# EAGLE design Stereo PGA2311 SMD v1,1 (EAGLE 7.5.0)
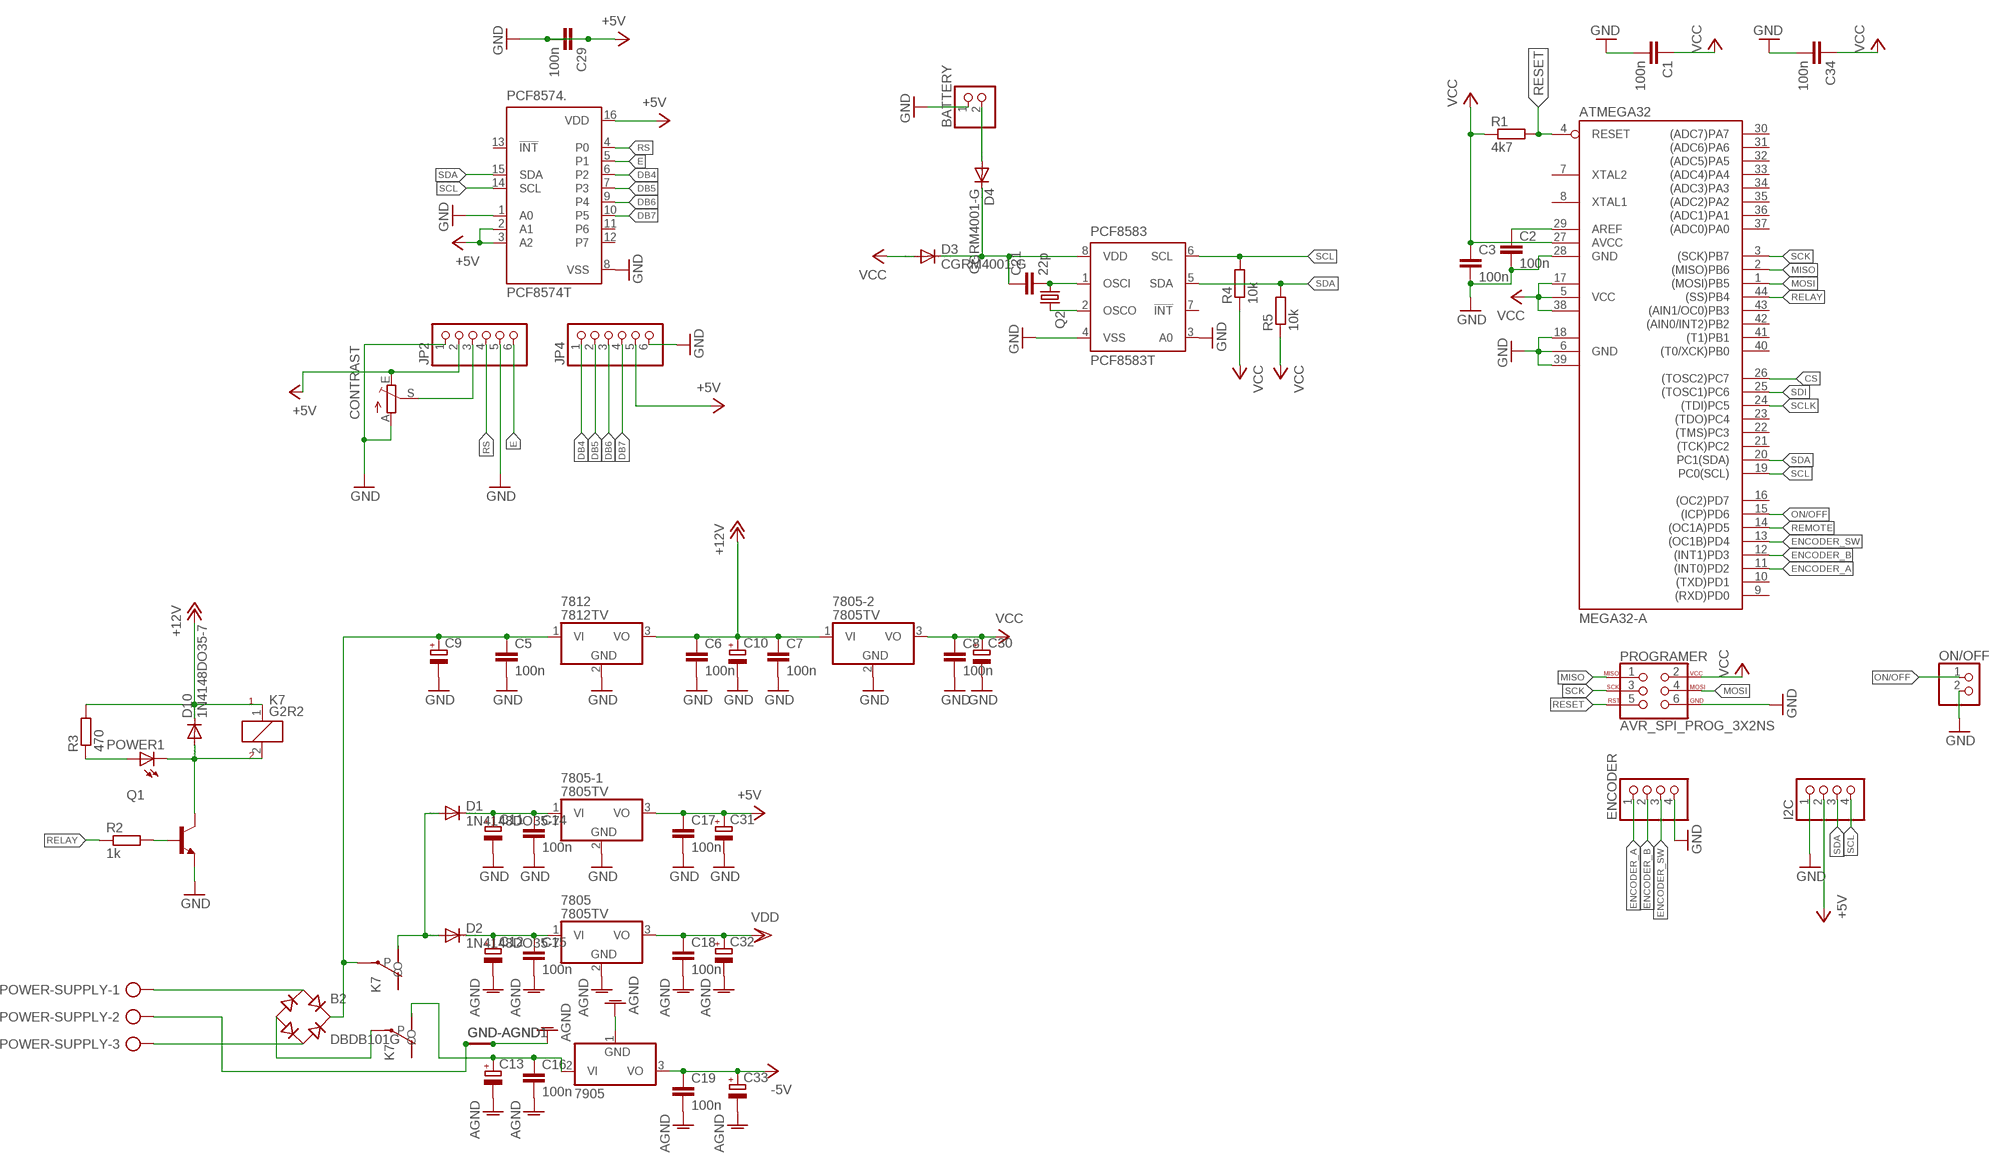
[diagram p0: schematic, sheet 1, part 1 of 2]
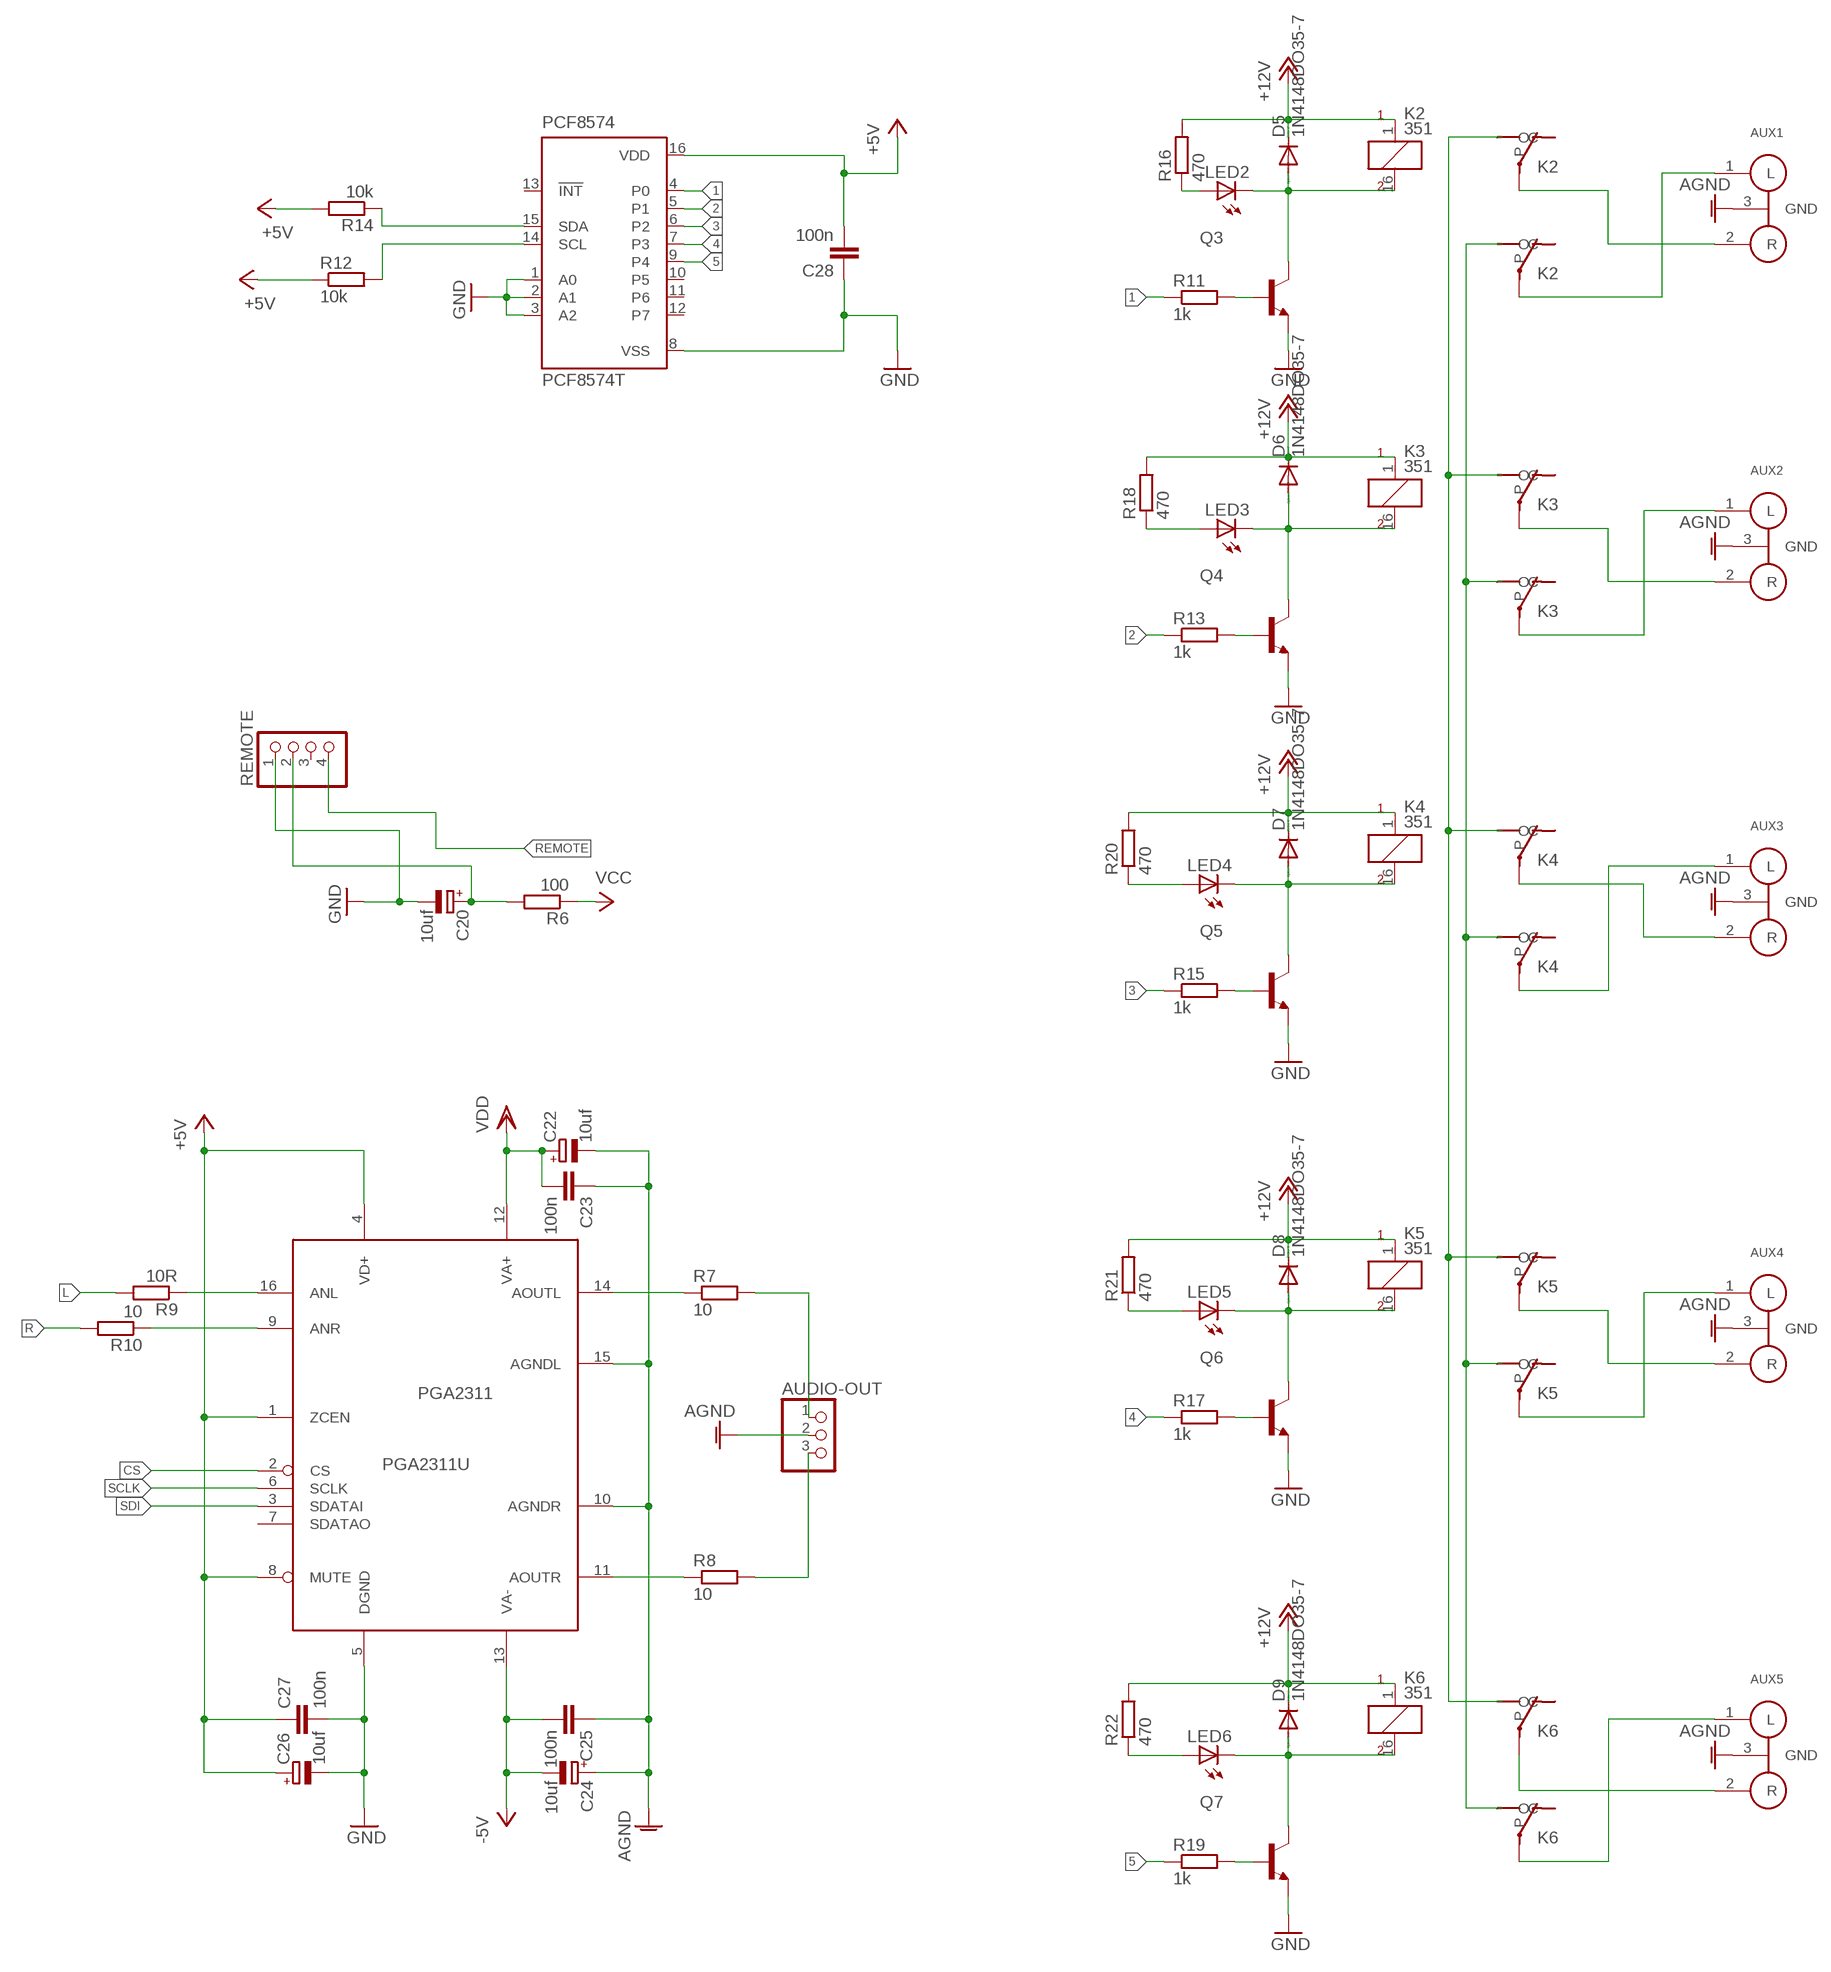
[diagram p1: schematic, sheet 1, part 2 of 2]

## Parts
7805  7805TV  [TO220V]
7805-1  7805TV  [TO220V]
7805-2  7805TV  [TO220V]
7812  7812TV  [TO220V]
7905  79  [TO220V]
ATMEGA32  MEGA32-A  [TQFP44]
AUDIO-OUT  PINHD-1X3  [1X03]
AUX1  RCA-EBAY  [RCA-EBAY]
AUX2  RCA-EBAY  [RCA-EBAY]
AUX3  RCA-EBAY  [RCA-EBAY]
AUX4  RCA-EBAY  [RCA-EBAY]
AUX5  RCA-EBAY  [RCA-EBAY]
B2  DBDB101G  [DB]
BATTERY  PINHD-1X2  [1X02]
C1  100n  C-EUC0805  [C0805]
C2  100n  C-EUC0603  [C0603]
C3  100n  C-EUC0603  [C0603]
C5  100n  C-EU025-030X050  [C025-030X050]
C6  100n  C-EU025-030X050  [C025-030X050]
C7  100n  C-EU025-030X050  [C025-030X050]
C8  100n  C-EU025-030X050  [C025-030X050]
C9  CPOL-EUE2.5-7  [E2,5-7]
C10  CPOL-EUE2.5-7  [E2,5-7]
C11  CPOL-EUE2.5-7  [E2,5-7]
C12  CPOL-EUE2.5-7  [E2,5-7]
C13  CPOL-EUE2.5-7  [E2,5-7]
C14  100n  C-EU025-030X050  [C025-030X050]
C15  100n  C-EU025-030X050  [C025-030X050]
C16  100n  C-EU025-030X050  [C025-030X050]
C17  100n  C-EU025-030X050  [C025-030X050]
C18  100n  C-EU025-030X050  [C025-030X050]
C19  100n  C-EU025-030X050  [C025-030X050]
C20  10uf  CPOL-EUE2-4  [E2-4]
C21  22p  C-EUC0603K  [C0603K]
C22  10uf  CPOL-EU153CLV-0505  [153CLV-0505]
C23  100n  C-EUC0603  [C0603]
C24  10uf  CPOL-EU153CLV-0505  [153CLV-0505]
C25  100n  C-EUC0603  [C0603]
C26  10uf  CPOL-EU153CLV-0505  [153CLV-0505]
C27  100n  C-EUC0603  [C0603]
C28  100n  C-EUC0603  [C0603]
C29  100n  C-EUC0603  [C0603]
C30  CPOL-EUE2.5-7  [E2,5-7]
C31  CPOL-EUE2.5-7  [E2,5-7]
C32  CPOL-EUE2.5-7  [E2,5-7]
C33  CPOL-EUE2.5-7  [E2,5-7]
C34  100n  C-EUC0603  [C0603]
CONTRAST  TRIM_EU-CA6V  [CA6V]
D1  1N4148DO35-7  [DO35-7]
D2  1N4148DO35-7  [DO35-7]
D3  CGRM4001-G  [SOD-123_MINI-SMA]
D4  CGRM4001-G  [SOD-123_MINI-SMA]
D5  1N4148DO35-7  [DO35-7]
D6  1N4148DO35-7  [DO35-7]
D7  1N4148DO35-7  [DO35-7]
D8  1N4148DO35-7  [DO35-7]
D9  1N4148DO35-7  [DO35-7]
D10  1N4148DO35-7  [DO35-7]
ENCODER  PINHD-1X4  [1X04]
GND-AGND  SHORT-HT5  [SHORT_TOP-50]
GND-AGND1  SHORT-HT5  [SHORT_TOP-50]
I2C  PINHD-1X4  [1X04]
JP2  PINHD-1X6  [1X06]
JP4  PINHD-1X6  [1X06]
K2  351  [351]
K3  351  [351]
K4  351  [351]
K5  351  [351]
K6  351  [351]
K7  G2R2  [G2R2]
LED2  LEDCHIPLED_0805  [CHIPLED_0805]
LED3  LEDCHIPLED_0805  [CHIPLED_0805]
LED4  LEDCHIPLED_0805  [CHIPLED_0805]
LED5  LEDCHIPLED_0805  [CHIPLED_0805]
LED6  LEDCHIPLED_0805  [CHIPLED_0805]
ON/OFF  PINHD-1X2  [1X02]
PCF8574  PCF8574T  [SO16W]
PCF8574.  PCF8574T  [SO16W]
PCF8583  PCF8583T  [SO8-7_5]
PGA2311  PGA2311U  [SO16-1]
POWER1  LEDCHIPLED_0805  [CHIPLED_0805]
POWER-SUPPLY  AK300/3  [AK300/3]
PROGRAMER  AVR_SPI_PROG_3X2NS  [2X3-NS]
Q1  BC547A-NPN-TO92-CBE  [TO92-CBE]
Q2  CRYSTALTC26H  [TC26H]
Q3  BC547A-NPN-TO92-CBE  [TO92-CBE]
Q4  BC547A-NPN-TO92-CBE  [TO92-CBE]
Q5  BC547A-NPN-TO92-CBE  [TO92-CBE]
Q6  BC547A-NPN-TO92-CBE  [TO92-CBE]
Q7  BC547A-NPN-TO92-CBE  [TO92-CBE]
R1  4k7  R-EU_R0603  [R0603]
R2  1k  R-EU_R0603  [R0603]
R3  470  R-EU_R0603  [R0603]
R4  10k  R-EU_R0603  [R0603]
R5  10k  R-EU_R0603  [R0603]
R6  100  R-EU_R0603  [R0603]
R7  10  R-EU_R0603  [R0603]
R8  10  R-EU_R0603  [R0603]
R9  10R  R-EU_R0603  [R0603]
R10  10  R-EU_R0603  [R0603]
R11  1k  R-EU_R0603  [R0603]
R12  10k  R-EU_R0603  [R0603]
R13  1k  R-EU_R0603  [R0603]
R14  10k  R-EU_R0603  [R0603]
R15  1k  R-EU_R0603  [R0603]
R16  470  R-EU_R0603  [R0603]
R17  1k  R-EU_R0603  [R0603]
R18  470  R-EU_R0603  [R0603]
R19  1k  R-EU_R0603  [R0603]
R20  470  R-EU_R0603  [R0603]
R21  470  R-EU_R0603  [R0603]
R22  470  R-EU_R0603  [R0603]
REMOTE  PINHD-1X4  [1X04]

## Nets
1: PCF8574.4(P0) R11.1
2: PCF8574.5(P1) R13.1
3: PCF8574.6(P2) R15.1
4: PCF8574.7(P3) R17.1
5: PCF8574.9(P4) R19.1
+5V: 7805-1.3(VO) C17.1 C26.+ C27.1 C28.2 C29.1 C29.2 C31.+ CONTRAST.E I2C.2 JP2.2 JP4.5 PCF8574.16(VDD) PCF8574..2(A1) PCF8574..3(A2) PCF8574..16(VDD) PGA2311.1(ZCEN) PGA2311.4(VD+) PGA2311.8(MUTE) R12.1 R14.2 ; supply symbol labelled GND
+12V: 7805-2.1(VI) 7812.3(VO) C6.1 C7.1 C10.+ D5.C D6.C D7.C D8.C D9.C D10.C K2.1 K3.1 K4.1 K5.1 K6.1 K7.1 R3.2 R16.2 R18.2 R20.2 R21.2 R22.2
-5V: 7905.3(VO) C19.1 C24.- C25.2 C33.+ PGA2311.13(VA-)
AGND: 7805.2(GND) 7905.1(GND) AUDIO-OUT.2 AUX1.3(GND) AUX2.3(GND) AUX3.3(GND) AUX4.3(GND) AUX5.3(GND) C12.- C13.- C15.2 C16.2 C18.2 C19.2 C22.- C23.1 C24.+ C25.1 C32.- C33.- GND-AGND1.2 GND-AGND.2 PGA2311.10(AGNDR) PGA2311.15(AGNDL)
CS: ATMEGA32.26((TOSC2)PC7) PGA2311.2(CS)
DB4: JP4.1 PCF8574..6(P2)
DB5: JP4.2 PCF8574..7(P3)
DB6: JP4.3 PCF8574..9(P4)
DB7: JP4.4 PCF8574..10(P5)
E: JP2.6 PCF8574..5(P1)
ENCODER_A: ATMEGA32.11((INT0)PD2) ENCODER.1
ENCODER_B: ATMEGA32.12((INT1)PD3) ENCODER.2
ENCODER_SW: ATMEGA32.13((OC1B)PD4) ENCODER.3
GND: 7805-1.2(GND) 7805-2.2(GND) 7812.2(GND) ATMEGA32.6(GND) ATMEGA32.18(GND1) ATMEGA32.28(GND) ATMEGA32.39(GND2) BATTERY.1 C1.2 C2.2 C3.2 C5.2 C6.2 C7.2 C8.2 C9.- C10.- C11.- C14.2 C17.2 C20.- C26.- C27.2 C28.1 C30.- C31.- C34.2 CONTRAST.A ENCODER.4 GND-AGND1.1 GND-AGND.1 I2C.1 JP2.1 JP2.5 JP4.6 ON/OFF.2 PCF8574.1(A0) PCF8574.2(A1) PCF8574.3(A2) PCF8574.8(VSS) PCF8574..1(A0) PCF8574..8(VSS) PCF8583.3(A0) PCF8583.4(VSS) PGA2311.5(DGND) POWER-SUPPLY.2 PROGRAMER.6 Q1.E Q3.E Q4.E Q5.E Q6.E Q7.E REMOTE.1
L: K2.S2(3:O) K3.S2(3:O) K4.S2(3:O) K5.S2(3:O) K6.S2(3:O) R9.2
MISO: ATMEGA32.2((MISO)PB6) PROGRAMER.1
MOSI: ATMEGA32.1((MOSI)PB5) PROGRAMER.4
N$1: B2.AC1 POWER-SUPPLY.1
N$2: B2.AC2 POWER-SUPPLY.3
N$3: ATMEGA32.29(AREF) C2.1
N$4: C21.2 PCF8583.1(OSCI) Q2.1
N$5: 7812.1(VI) B2.+ C5.1 C9.+ K7.P2(3:P)
N$6: B2.- K7.P1(2:P)
N$7: 7905.2(VI) C13.+ C16.1 K7.S1(2:O)
N$8: D1.A D2.A K7.S2(3:O)
N$9: 7805.1(VI) C12.+ C15.1 D2.C
N$10: 7805-1.1(VI) C11.+ C14.1 D1.C
N$11: D10.A K7.2 POWER1.C Q1.C
N$12: Q1.B R2.2
N$13: PCF8583.2(OSCO) Q2.2
N$14: C21.1 D3.C D4.C PCF8583.8(VDD)
N$15: BATTERY.2 D4.A
N$16: PGA2311.11(AOUTR) R8.1
N$17: C20.+ R6.2 REMOTE.2
N$18: PGA2311.16(ANL) R9.1
N$19: PGA2311.9(ANR) R10.1
N$20: PGA2311.14(AOUTL) R7.1
N$21: D5.A K2.16 LED2.C Q3.C
N$22: Q3.B R11.2
N$23: LED2.A R16.1
N$24: Q4.B R13.2
N$25: LED3.A R18.1
N$26: Q5.B R15.2
N$27: LED4.A R20.1
N$28: Q6.B R17.2
N$29: LED5.A R21.1
N$30: Q7.B R19.2
N$31: LED6.A R22.1
N$32: D6.A K3.16 LED3.C Q4.C
N$33: AUDIO-OUT.1 R7.2
N$34: AUDIO-OUT.3 R8.2
N$35: AUX5.1(L) K6.P2(3:P)
N$36: AUX5.2(R) K6.P1(2:P)
N$37: AUX4.1(L) K5.P2(3:P)
N$38: AUX4.2(R) K5.P1(2:P)
N$39: AUX3.2(R) K4.P1(2:P)
N$40: AUX3.1(L) K4.P2(3:P)
N$41: AUX2.1(L) K3.P2(3:P)
N$42: AUX2.2(R) K3.P1(2:P)
N$43: AUX1.1(L) K2.P2(3:P)
N$44: AUX1.2(R) K2.P1(2:P)
N$45: D7.A K4.16 LED4.C Q5.C
N$46: D8.A K5.16 LED5.C Q6.C
N$47: D9.A K6.16 LED6.C Q7.C
N$48: POWER1.A R3.1
N$93: CONTRAST.S JP2.3
ON/OFF: ATMEGA32.15((ICP)PD6) ON/OFF.1
R: K2.S1(2:O) K3.S1(2:O) K4.S1(2:O) K5.S1(2:O) K6.S1(2:O) R10.2
RELAY: ATMEGA32.44((SS)PB4) R2.1
REMOTE: ATMEGA32.14((OC1A)PD5) REMOTE.4
RESET: ATMEGA32.4(RESET) PROGRAMER.5 R1.2
RS: JP2.4 PCF8574..4(P0)
SCK: ATMEGA32.3((SCK)PB7) PROGRAMER.3
SCL: ATMEGA32.19(PC0(SCL)) I2C.4 PCF8574.14(SCL) PCF8574..14(SCL) PCF8583.6(SCL) R4.2 R12.2
SCLK: ATMEGA32.24((TDI)PC5) PGA2311.6(SCLK)
SDA: ATMEGA32.20(PC1(SDA)) I2C.3 PCF8574.15(SDA) PCF8574..15(SDA) PCF8583.5(SDA) R5.2 R14.1
SDI: ATMEGA32.25((TOSC1)PC6) PGA2311.3(SDATAI)
VCC: 7805-2.3(VO) ATMEGA32.5(VCC) ATMEGA32.17(VCC1) ATMEGA32.27(AVCC) ATMEGA32.38(VCC2) C1.1 C3.1 C8.1 C30.+ C34.1 D3.A PROGRAMER.2 R1.1 R4.1 R5.1 R6.1
VDD: 7805.3(VO) C18.1 C22.+ C23.2 C32.+ PGA2311.12(VA+)
Unconnected: ATMEGA32.7(XTAL2) ATMEGA32.8(XTAL1) ATMEGA32.9((RXD)PD0) ATMEGA32.10((TXD)PD1) ATMEGA32.16((OC2)PD7) ATMEGA32.21((TCK)PC2) ATMEGA32.22((TMS)PC3) ATMEGA32.23((TDO)PC4) ATMEGA32.30((ADC7)PA7) ATMEGA32.31((ADC6)PA6) ATMEGA32.32((ADC5)PA5) ATMEGA32.33((ADC4)PA4) ATMEGA32.34((ADC3)PA3) ATMEGA32.35((ADC2)PA2) ATMEGA32.36((ADC1)PA1) ATMEGA32.37((ADC0)PA0) ATMEGA32.40((T0/XCK)PB0) ATMEGA32.41((T1)PB1) ATMEGA32.42((AIN0/INT2)PB2) ATMEGA32.43((AIN1/OC0)PB3) K2.O1(2:C) K2.O2(3:C) K3.O1(2:C) K3.O2(3:C) K4.O1(2:C) K4.O2(3:C) K5.O1(2:C) K5.O2(3:C) K6.O1(2:C) K6.O2(3:C) K7.O1(2:C) K7.O2(3:C) PCF8574.10(P5) PCF8574.11(P6) PCF8574.12(P7) PCF8574.13(!INT) PCF8574..11(P6) PCF8574..12(P7) PCF8574..13(!INT) PCF8583.7(!INT) PGA2311.7(SDATAO) REMOTE.3

## Library data of the parts
7805 7805-1 7805-2 7812 = linear:78*: Positive VOLTAGE REGULATOR Source: http://cache.national.com/ds/LM/LM78L05.pdf http://www.fairchildsemi.com/ds/LM/LM7805.pdf
7905 = linear3:79*: Negative VOLTAGE REGULATOR
ATMEGA32 = atmel:MEGA32: MICROCONTROLLER 32 Kbytes FLASH 2 Kbytes SRAM 1 Kbytes EEPROM USART 8-channel 10 bit ADC Source: www.atmel.com .. doc2503.pdf; MPN: ATMEGA32-16AU; OC_FARNELL: 9171274; OC_NEWARK: 69K6677
AUDIO-OUT = pinhead:PINHD-1X3: PIN HEADER
AUX1-AUX5 = Rca-Ebay:RCA-EBAY
B2 = rectifier:DB?*G: Single Phase 1.0 AMP Glass Passivated Bridge Rectifier Taiwan Semiconductor Co.,Ltd. - TSC Source: http://www.taiwansemi.com/TSCbig5/ezcatfiles/cust/img/img/db101g.pdf http://www.ts.com.tw/db/pictures/modules/PDT/PDT060207001/DBLS201G.pdf
BATTERY ON/OFF = pinhead:PINHD-1X2: PIN HEADER
C1-C3 C5-C8 C14-C19 C21 C23 C25 C27-C29 C34 = rcl:C-EU: CAPACITOR, European symbol
C9-C13 C20 C22 C24 C26 C30-C33 = rcl:CPOL-EU: POLARIZED CAPACITOR, European symbol
CONTRAST = pot:TRIM_EU-: POTENTIOMETER
D1 D2 D5-D10 = diode:1N4148: DIODE high speed (Philips)
D3 D4 = diode:CGRM400*-G: Molded plasitc,JEDEC SOD-123/Mini SMA Source: Comchip CGRM4001-G.pdf
ENCODER I2C REMOTE = pinhead:PINHD-1X4: PIN HEADER
GND-AGND GND-AGND1 = shorts-old:SHORT-H: Short between two nets; BOM: no
JP2 JP4 = pinhead:PINHD-1X6: PIN HEADER
K2-K6 = relay:351: RELAY 2 x switch, Omron; OC_FARNELL: unknown; OC_NEWARK: unknown
K7 = relay:G2R2: RELAY 2 x switch, Omron; MF: OMRON COMPONENTS USA; MPN: G2R-2-DC6; OC_FARNELL: unknown; OC_NEWARK: 89C5317
LED2-LED6 POWER1 = led:LED: LED OSRAM: - CHIPLED LG R971, LG N971, LY N971, LG Q971, LY Q971, LO R971, LY R971 LH N974, LH R974 LS Q976, LO Q976, LY Q976 LO Q996 - Hyper CHIPLED LW Q18S LB Q993, LB Q99A, LB R99A - SideLED LS A670, LO A670, LY A670, LG A670, LP A670 LB A673, LV A673, LT A673, LW A673 LH A674 LY A675 LS A676, LA A676, LO A676, LY A676, LW A676 LS A679, LY A679, LG A679 - Hyper Micro SIDELED® LS Y876, LA Y876, LO Y876, LY Y876 LT Y87S - SmartLED LW L88C, LW L88S LB L89C, LB L89S, LG L890 LS L89K, LO L89K, LY L89K LS L896, LA L896, LO L896, LY L896 - TOPLED LS T670, LO T670, LY T670, LG T670, LP T670 LSG T670, LSP T670, LSY T670, LOP T670, LYG T670 LG T671, LOG T671, LSG T671 LB T673, LV T673, LT T673, LW T673 LH T674 LS T676, LA T676, LO T676, LY T676, LB T676, LH T676, LSB T676, LW T676 LB T67C, LV T67C, LT T67C, LS T67K, LO T67K, LY T67K, LW E67C LS E67B, LA E67B, LO E67B, LY E67B, LB E67C, LV E67C, LT E67C LW T67C LS T679, LY T679, LG T679 LS T770, LO T770, LY T770, LG T770, LP T770 LB T773, LV T773, LT T773, LW T773 LH T774 LS E675, LA E675, LY E675, LS T675 LS T776, LA T776, LO T776, LY T776, LB T776 LHGB T686 LT T68C, LB T68C - Hyper Mini TOPLED® LB M676 - Mini TOPLED Santana® LG M470 LS M47K, LO M47K, LY M47K Source: http://www.osram.convergy.de LUXEON: - LUMILED® LXK2-PW12-R00, LXK2-PW12-S00, LXK2-PW14-U00, LXK2-PW14-V00 LXK2-PM12-R00, LXK2-PM12-S00, LXK2-PM14-U00 LXK2-PE12-Q00, LXK2-PE12-R00, LXK2-PE12-S00, LXK2-PE14-T00, LXK2-PE14-U00 LXK2-PB12-K00, LXK2-PB12-L00, LXK2-PB12-M00, LXK2-PB14-N00, LXK2-PB14-P00, LXK2-PB14-Q00 LXK2-PR12-L00, LXK2-PR12-M00, LXK2-PR14-Q00, LXK2-PR14-R00 LXK2-PD12-Q00, LXK2-PD12-R00, LXK2-PD12-S00 LXK2-PH12-R00, LXK2-PH12-S00 LXK2-PL12-P00, LXK2-PL12-Q00, LXK2-PL12-R00 Source: www.luxeon.com KINGBRIGHT: KA-3528ASYC Source: www.kingbright.com
PCF8574 PCF8574. = micro-philips:PCF8574: I2C-Bus Remote 8-bit I/O expander http://www.semiconductors.philips.com/acrobat_download/datasheets/PCF8574_4.pdf; MPN: PCF8574T/3,512; OC_FARNELL: 1201255; OC_NEWARK: 70R6870
PCF8583 = ds1307_pcf8583:PCF8583: I2C-Bus CLOCK/CALENDAR
PGA2311 = PGA2311:PGA2311
POWER-SUPPLY = con-ptr500:AK300/3: CONNECTOR; OC_FARNELL: unknown; OC_NEWARK: unknown
PROGRAMER = SparkFun-Connectors:AVR_SPI_PROG_3X2: AVR ISP 6 Pin This is the reduced ISP connector for AVR programming. Common on Arduino. This footprint will take up less PCB space and can be used with a 10-pin to 6-pin adapter such as SKU: BOB-08508 **Special note about "TEST_POINT" package. The stop mask is on the top side, so if you want your programming test points to be on the bottom of your board, make sure to place this package on the bottom side of the board. This also ensure that the orientation to program from the bottom side will be correct. SparkFun Products: SparkFun ISP Pogo Adapter <https://www.sparkfun.com/products/11591> - NS Tiny AVR Programmer <https://www.sparkfun.com/products/11801> -PTH
Q1 Q3-Q7 = transistor:*-NPN-: NPN Transistror BF959 corrected 2008.03.06
Q2 = crystal:CRYSTAL: CRYSTAL; OC_FARNELL: unknown; OC_NEWARK: unknown
R1-R22 = rcl:R-EU_: RESISTOR, European symbol

## Board
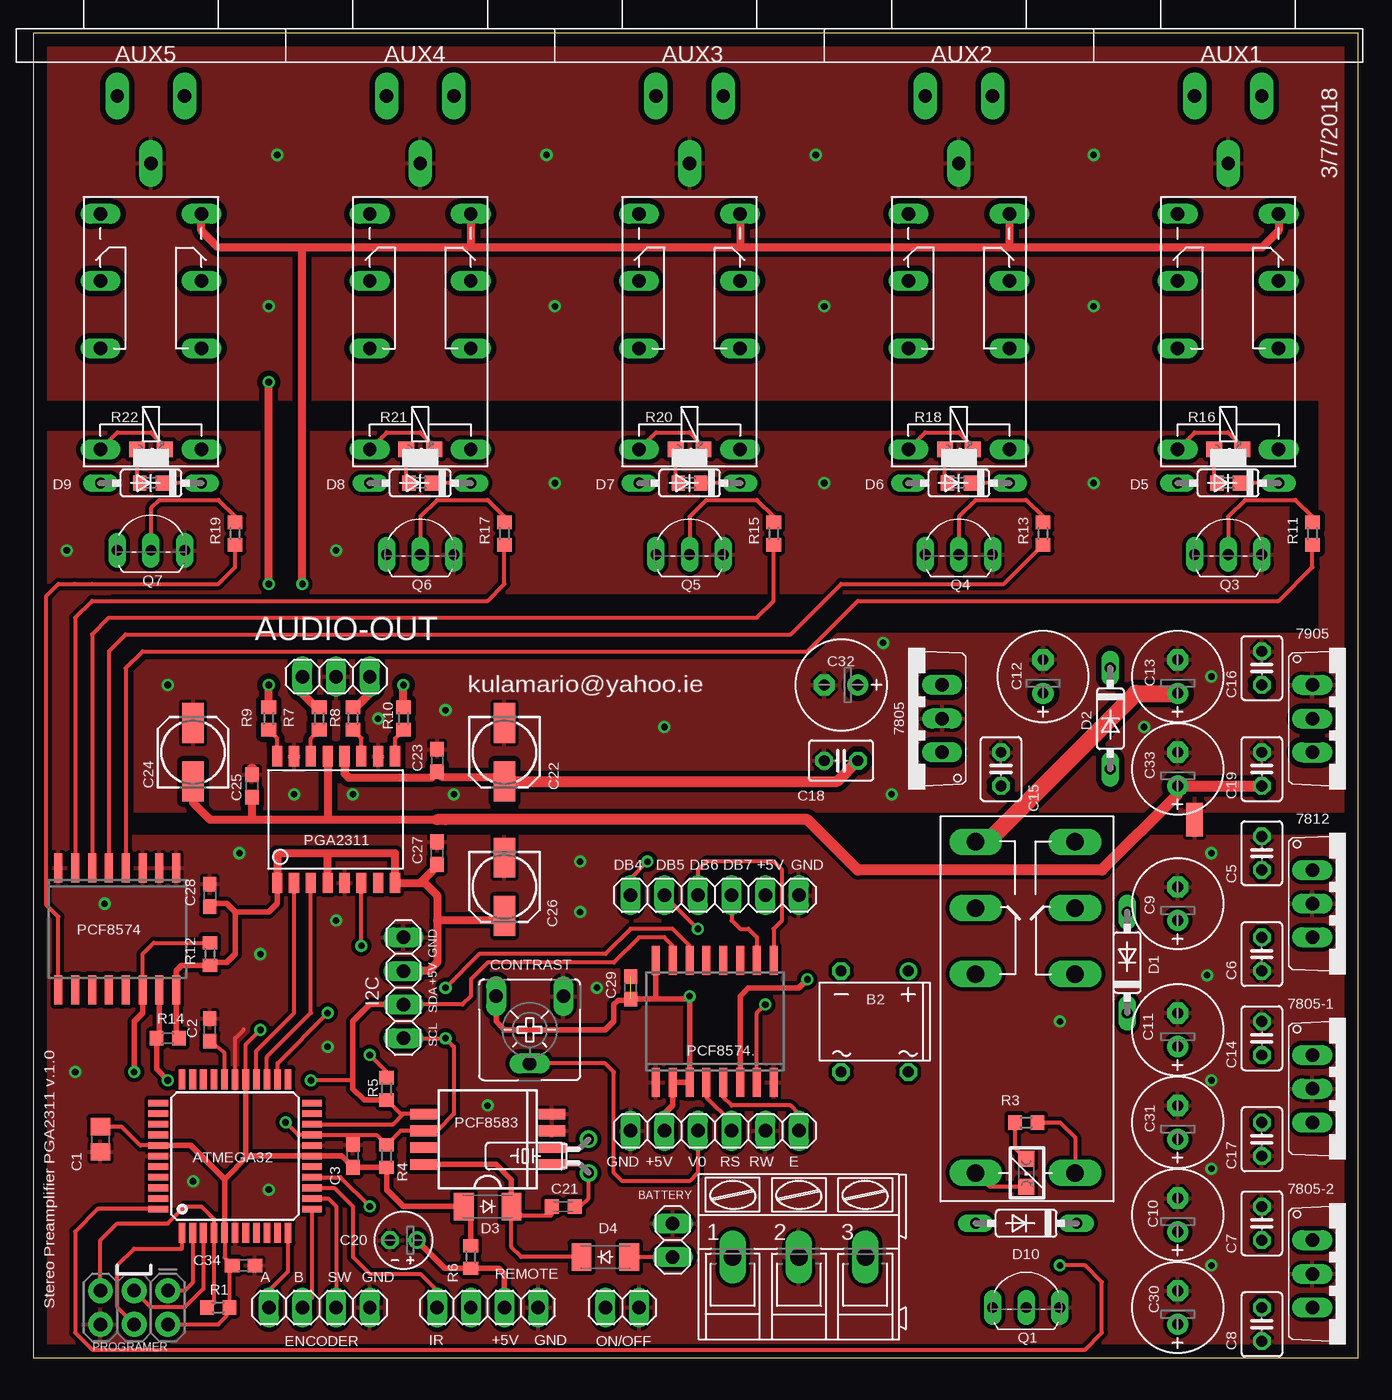
[diagram p2: board, top side]
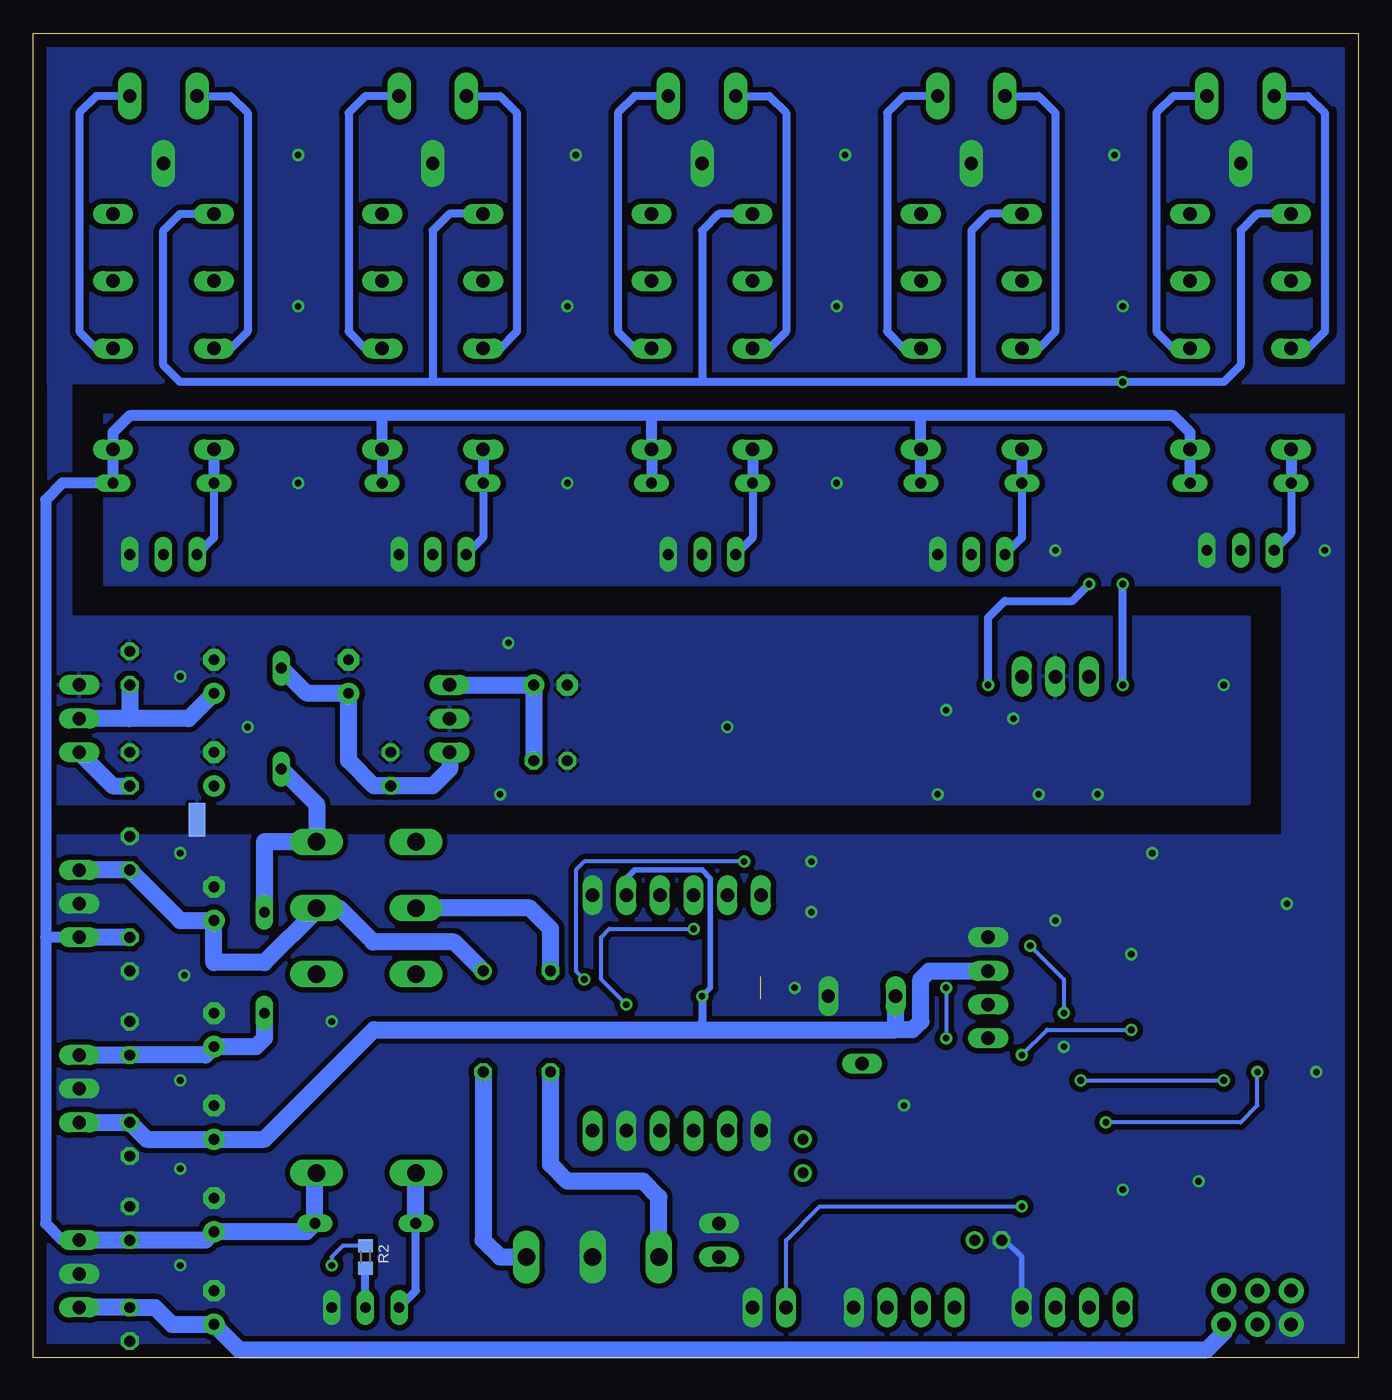
[diagram p3: board, bottom side, seen from below]

Size 100 x 100 mm. Coordinates in mm from the lower left corner, seen from the top.
Outline: 0,0 100,0 100,100 0,100 0,0
Copper layers (1*16): Top 0.035mm / dielectric 1.5mm / Bottom 0.035mm
Design rules "default": minimum track width 10mil, minimum drill 24mil, track to track 8mil, track to pad 8mil, pad to pad 8mil, via to via 8mil, smd to smd 8mil, copper to edge 40mil, drill to drill 8mil, minimum pad ring 10mil, minimum via ring 8mil, stop-mask expansion 4mil, vias tented up to drill 0mil, thermal gap 10mil

### Footprints (pad centres in the part's own frame; a part is rotated, then mirrored left to right if it is on the bottom)
TO220V = drill 1.016 long: 1 -2.54,-2.54; 2 0,-2.54; 3 2.54,-2.54
TQFP44 = smd 1.5 x 0.5: 1 -5.8,4; 2 -5.8,3.2; 3 -5.8,2.4; 4 -5.8,1.6; 5 -5.8,0.8; 6 -5.8,0; 7 -5.8,-0.8; 8 -5.8,-1.6; 9 -5.8,-2.4; 10 -5.8,-3.2; 11 -5.8,-4; 23 5.8,-4; 24 5.8,-3.2; 25 5.8,-2.4; 26 5.8,-1.6; 27 5.8,-0.8; 28 5.8,0; 29 5.8,0.8; 30 5.8,1.6; 31 5.8,2.4; 32 5.8,3.2; 33 5.8,4 | smd 0.5 x 1.5: 12 -4,-5.8; 13 -3.2,-5.8; 14 -2.4,-5.8; 15 -1.6,-5.8; 16 -0.8,-5.8; 17 0,-5.8; 18 0.8,-5.8; 19 1.6,-5.8; 20 2.4,-5.8; 21 3.2,-5.8; 22 4,-5.8; 34 4,5.8; 35 3.2,5.8; 36 2.4,5.8; 37 1.6,5.8; 38 0.8,5.8; 39 0,5.8; 40 -0.8,5.8; 41 -1.6,5.8; 42 -2.4,5.8; 43 -3.2,5.8; 44 -4,5.8
1X03 = drill 1.016 long: 1 -2.54,0; 2 0,0; 3 2.54,0
RCA-EBAY = drill 1 pad 1.778 long: 1 -2.54,1.27; 2 2.54,1.27; 3 0,-3.81
DB = drill 0.813: + -2.54,-3.81 | drill 0.813 octagon: - 2.54,-3.81; AC1 2.54,3.81; AC2 -2.54,3.81
1X02 = drill 1.016 long: 1 -1.27,0; 2 1.27,0
C0805 = smd 1.3 x 1.5: 1 -0.95,0; 2 0.95,0
C0603 = smd 1.1 x 1: 1 -0.85,0; 2 0.85,0
C025-030X050 = drill 0.813 octagon: 1 -1.27,0; 2 1.27,0
E2,5-7 = drill 0.813 pad 1.6: + -1.27,0 | drill 0.813 pad 1.6 octagon: - 1.27,0
E2-4 = drill 0.813 pad 1.27: + -1.016,0 | drill 0.813 pad 1.27 octagon: - 1.016,0
C0603K = smd 1.05 x 1.08: 1 -0.875,0; 2 0.875,0
153CLV-0505 = smd 3 x 1.6: + 2.2,0; - -2.2,0
CA6V = drill 1.016 long: A -2.54,-2.54; E 2.54,-2.54; S 0,2.54
DO35-7 = drill 0.813 long: A 3.81,0; C -3.81,0
SOD-123_MINI-SMA = smd 1.5 x 2.1: A 1.8,0; C -1.8,0
1X04 = drill 1.016 long: 1 -3.81,0; 2 -1.27,0; 3 1.27,0; 4 3.81,0
SHORT_TOP-50 = smd 1.27 x 1.27: 1 0.635,0; 2 -0.635,0
1X06 = drill 1.016 long: 1 -6.35,0; 2 -3.81,0; 3 -1.27,0; 4 1.27,0; 5 3.81,0; 6 6.35,0
351 = drill 1.016 long: 1 -3.81,-3.81; 16 -3.81,3.81; O1 8.89,-3.81; O2 8.89,3.81; P1 3.81,-3.81; P2 3.81,3.81; S1 13.97,-3.81; S2 13.97,3.81
G2R2 = drill 1.321 long: 1 -2.54,-3.683; 2 -2.54,3.81; O1 12.471,3.81; O2 12.471,-3.683; P1 17.45,3.81; P2 17.45,-3.683; S1 22.454,3.81; S2 22.454,-3.683
CHIPLED_0805 = smd 1.2 x 1.2: A 0,-1.05; C 0,1.05
SO16W = smd 0.6 x 2.2: 1 -4.445,-4.6; 2 -3.175,-4.6; 3 -1.905,-4.6; 4 -0.635,-4.6; 5 0.635,-4.6; 6 1.905,-4.6; 7 3.175,-4.6; 8 4.445,-4.6; 9 4.445,4.6; 10 3.175,4.6; 11 1.905,4.6; 12 0.635,4.6; 13 -0.635,4.6; 14 -1.905,4.6; 15 -3.175,4.6; 16 -4.445,4.6
SO8-7_5 = smd 0.8 x 2: 1 -1.905,-4.845; 2 -0.635,-4.845; 3 0.635,-4.845; 4 1.905,-4.845; 5 1.905,4.845; 6 0.635,4.845; 7 -0.635,4.845; 8 -1.905,4.845
SO16-1 = smd 0.762 x 1.524: 1 -4.445,-4.775; 2 -3.175,-4.775; 3 -1.905,-4.775; 4 -0.635,-4.775; 5 0.635,-4.775; 6 1.905,-4.775; 7 3.175,-4.775; 8 4.445,-4.775; 9 4.445,4.775; 10 3.175,4.775; 11 1.905,4.775; 12 0.635,4.775; 13 -0.635,4.775; 14 -1.905,4.775; 15 -3.175,4.775; 16 -4.445,4.775
AK300/3 = drill 1.321 long: 1 -5.004,0; 2 0,0; 3 5.004,0
2X3-NS = drill 1.016 pad 1.88: 1 -2.54,-1.27; 2 -2.54,1.27; 3 0,-1.27; 4 0,1.27; 5 2.54,-1.27; 6 2.54,1.27
TO92-CBE = drill 0.813 long: B 0,0; C -2.54,0; E 2.54,0
TC26H = drill 0.813: 1 -1.27,0; 2 1.27,0
R0603 = smd 1 x 1.1: 1 -0.85,0; 2 0.85,0

### Placement (x,y rotation side)
7805  66.04,48.26 90 top
7805-1  99.06,20.32 270 top
7805-2  99.06,6.35 270 top
7812  99.06,34.29 270 top
7905  99.06,48.26 270 top
ATMEGA32  15.24,15.24 90 top
AUDIO-OUT  22.86,51.44 0 top
AUX1  90.17,93.98 0 top
AUX2  69.85,93.98 0 top
AUX3  49.53,93.98 0 top
AUX4  29.21,93.98 0 top
AUX5  8.89,93.98 0 top
B2  63.5,25.4 180 top
BATTERY  48.26,8.89 270 top
C1  5.08,16.51 270 top
C2  13.34,24.77 90 top
C3  24.13,15.24 90 top
C5  92.71,38.1 90 top
C6  92.71,30.48 270 top
C7  92.71,10.16 90 top
C8  92.71,2.54 270 top
C9  86.36,34.29 90 top
C10  86.36,10.79 90 top
C11  86.36,24.77 90 top
C12  76.2,51.44 90 top
C13  86.36,51.44 90 top
C14  92.71,24.13 90 top
C15  73.03,44.45 90 top
C16  92.71,52.07 90 top
C17  92.71,16.51 270 top
C18  60.96,45.09 180 top
C19  92.71,44.45 90 top
C20  27.94,8.89 180 top
C21  40.01,11.43 0 top
C22  35.56,45.72 270 top
C23  30.48,45.09 270 top
C24  12.06,45.72 90 top
C25  16.51,43.18 270 top
C26  35.56,35.56 270 top
C27  30.48,38.1 90 top
C28  13.34,34.92 270 top
C29  45.09,27.94 90 top
C30  86.36,3.81 90 top
C31  86.36,17.78 90 top
C32  60.96,50.8 180 top
C33  86.36,44.45 90 top
C34  15.88,6.99 0 top
CONTRAST  37.47,24.77 180 top
D1  82.55,29.84 90 top
D2  81.28,48.26 270 top
D3  34.29,11.43 180 top
D4  43.18,7.62 0 top
D5  90.17,66.04 180 top
D6  69.85,66.04 180 top
D7  49.53,66.04 180 top
D8  29.21,66.04 180 top
D9  8.89,66.04 180 top
D10  74.93,10.16 180 top
ENCODER  21.59,3.81 0 top
GND-AGND  87.63,40.64 270 bottom
GND-AGND1  87.63,40.64 270 top
I2C  27.94,27.94 270 top
JP2  51.44,17.14 0 top
JP4  51.44,34.92 0 top
K2  90.17,72.39 90 top
K3  69.85,72.39 90 top
K4  49.53,72.39 90 top
K5  29.21,72.39 90 top
K6  8.89,72.39 90 top
K7  74.93,16.51 90 top
LED2  90.17,68.58 270 top
LED3  69.85,68.58 270 top
LED4  49.53,68.58 270 top
LED5  29.21,68.58 270 top
LED6  8.89,68.58 270 top
ON/OFF  44.45,3.81 0 top
PCF8574  6.35,32.38 180 top
PCF8574.  51.44,25.4 0 top
PCF8583  34.29,16.51 90 top
PGA2311  22.86,40.64 0 top
POWER1  74.93,13.97 180 top
POWER-SUPPLY  57.78,7.62 0 top
PROGRAMER  7.62,3.81 180 top
Q1  74.93,3.81 0 top
Q2  41.91,15.24 90 top
Q3  90.17,60.64 0 top
Q4  69.85,60.64 0 top
Q5  49.53,60.64 0 top
Q6  29.21,60.64 0 top
Q7  8.89,60.96 0 top
R1  13.97,3.81 180 top
R2  74.93,7.62 270 bottom
R3  74.93,17.78 0 top
R4  26.67,15.24 90 top
R5  26.67,20.32 270 top
R6  33.02,7.62 270 top
R7  21.59,48.26 90 top
R8  24.13,48.26 90 top
R9  17.78,48.26 90 top
R10  27.94,48.26 90 top
R11  96.52,62.23 90 top
R12  13.34,30.48 90 top
R13  76.2,62.23 90 top
R14  10.16,24.13 0 top
R15  55.88,62.23 90 top
R16  90.17,66.04 0 top
R17  35.56,62.23 90 top
R18  69.85,66.04 0 top
R19  15.24,62.23 90 top
R20  49.53,66.04 0 top
R21  29.21,66.04 0 top
R22  8.89,66.04 0 top
REMOTE  34.29,3.81 180 top

### Tracks (layer width: path | path; a pad name or v marks a point on that pad's centre or on a via)
1
  Top 0.305: R11.1 96.52,59.69 93.98,57.15 62.23,57.15 58.42,53.34 8.26,53.34 6.99,52.07 PCF8574.4
2
  Top 0.305: R13.1 73.24,58.42 60.96,58.42 57.15,54.61 6.99,54.61 5.71,53.34 PCF8574.5
3
  Top 0.305: R15.1 55.88,57.15 54.61,55.88 5.71,55.88 4.45,54.61 PCF8574.6
4
  Top 0.305: R17.1 35.56,58.42 34.29,57.15 4.45,57.15 3.17,55.88 PCF8574.7
5
  Top 0.305: R19.1 15.24,59.69 13.97,58.42 4.45,58.42 4.43,58.43 3.14,58.43 3.13,58.42 1.91,58.42 1.01,57.52 1.01,34.19 1.91,33.29 PCF8574.9
+5V  (via drill 0.5)  (1 unrouted)
  Top 0.305: 49.52,27.29 v49.53,27.3 | R12.1 13.55,29.84
  Top 0.406: R14.2 10.79,24.34 PCF8574.16 10.79,29.21 11.21,29.63 R12.1 | 13.55,29.84 14.61,29.84 15.24,30.48 15.24,33.66 | 15.24,33.66 14.61,34.29 13.35,34.29 C28.2 | PGA2311.1 18.41,34.29 17.78,33.66 15.24,33.66 | JP2.2 47.62,18.41 48.26,19.05 PCF8574..2 PCF8574..3 v49.53,27.3 49.31,27.09 46.99,27.09 | CONTRAST.E 34.92,25.4 35.56,24.77 43.18,24.77 43.81,25.4 43.81,26.67 44.13,26.99 44.98,26.99 C29.1 46.99,27.09 | PCF8574..16 46.99,27.09
  Top 0.61: 22.23,38.1 27.3,38.1 PGA2311.8 29.21,35.87 | 22.23,38.1 18.41,38.1 PGA2311.1 | PGA2311.4 22.23,38.1 | 29.21,35.87 29.54,35.87 30.48,34.92 30.48,33.02 | 30.48,33.02 30.48,29.84 29.84,29.21 I2C.2 | 29.21,35.87 30.48,37.13 C27.1 | C26.+ 35.56,33.02 30.48,33.02
  Bottom 0.406: JP4.5 55.24,36.2 54.61,36.83 49.53,36.83 48.9,36.2 48.9,27.94 v49.53,27.3
  Bottom 0.61: v49.53,27.3 49.53,25.4
  Bottom 1.27: 7805-1.3 C17.1 91.44,16.51 C31.+ 82.55,16.51 74.3,24.77 34.92,24.77 | I2C.2 32.38,29.21 33.02,28.57 33.02,25.4 33.66,24.77 34.92,24.77 | 34.92,24.77 CONTRAST.E
+12V
  Top 0.305: D5.C R16.2 | D6.C R18.2 | D9.C R22.2 | D8.C R21.2 | D7.C R20.2 | R3.2 77.47,17.78 78.61,16.64 K7.1
  Bottom 0.813: D9.C K6.1 12.7,69.85 13.97,71.12 33.02,71.12 | 33.02,71.12 53.34,71.12 | 53.34,71.12 73.66,71.12 | 73.66,71.12 92.71,71.12 93.98,69.85 K2.1 D5.C 97.79,66.04 99.06,64.77 99.06,31.75 | 73.66,71.12 K3.1 D6.C | 53.34,71.12 K4.1 D7.C | 33.02,71.12 K5.1 D8.C | 99.06,31.75 99.06,10.16 97.79,8.89 7805-2.1 | C6.1 99.06,31.75
  Bottom 1.27: 7805-2.1 C7.1 87,8.89 C10.+ 79.38,9.53 D10.C 78.74,13.84 K7.1 | C6.1 7812.3
-5V
  Top 0.61: 16.51,40.64 22.23,40.64 | PGA2311.13 22.23,40.64 | C25.2 16.51,40.64 | C24.- 12.06,41.91 13.34,40.64 16.51,40.64 | 22.23,40.64 31.11,40.64
  Top 0.813: 30.48,40.64 31.11,40.64 58.42,40.64 62.23,36.83 80.64,36.83 86.36,42.55 C33.+ C19.1
  Bottom 1.27: 7905.3 93.98,43.18 C19.1
AGND  (via drill 0.5)
  Top 0.813: 16.51,44.45 C25.1
  other vias: 59.05,90.81 38.73,90.81 26.04,48.26 47.62,47.62 24.13,42.55 19.68,42.55 64.77,42.55 18.41,90.81 80.01,90.81 39.37,79.38 17.78,79.38 80.01,79.38 59.69,79.38 83.82,47.62 10.16,50.8 64.14,53.98 88.9,51.44 31.11,48.9 31.75,42.55
  pour Bottom (isolate 0.61, no thermals): 0,100.33 100.33,100.33 100.33,73.66 0,73.66
  pour Top (isolate 0.406): 0,100.33 99.69,100.33 99.69,41.27 7.62,41.27 7.62,54.61 97.16,54.61 97.16,72.39 0,72.39
  pour Bottom (isolate 0.406): 1.91,100.33 99.06,99.69 99.06,41.91 8.26,41.91 8.26,55.88 97.16,55.88 97.16,73.66 1.91,74.3
CS
  Top 0.305: ATMEGA32.26 16.84,23.19 19.68,26.04 PGA2311.2
DB4  (via drill 0.5)
  Top 0.305: JP4.1 45.09,36.2 v46.35,37.47
  Top 0.406: PCF8574..6 53.34,27.3 53.98,27.94 57.78,27.94 v58.42,28.57
  Bottom 0.305: v46.35,37.47 58.42,37.47 59.05,36.83 59.05,29.21 v58.42,28.57
DB5  (via drill 0.5)
  Top 0.305: v50.16,32.38 JP4.2 | PCF8574..7 54.61,26.04 v55.24,26.67
  Bottom 0.305: v55.24,26.67 57.15,28.57 57.15,31.75 56.52,32.38 v50.16,32.38
DB6
  Top 0.305: JP4.3 50.16,36.83 50.8,37.47 55.88,37.47 56.52,36.83 56.52,33.02 55.88,32.38 PCF8574..9
DB7
  Top 0.305: JP4.4 52.7,33.02 53.34,32.38 53.98,32.38 54.61,31.75 PCF8574..10
E
  Top 0.305: JP2.6 57.78,18.41 57.15,19.05 52.7,19.05 52.07,19.68 PCF8574..5
ENCODER_A
  Top 0.305: ENCODER.1 17.78,5.08 19.24,6.54 ATMEGA32.11
ENCODER_B
  Top 0.305: ATMEGA32.12 21.04,4.53 ENCODER.2
ENCODER_SW
  Top 0.305: ATMEGA32.13 22.25,12.04 22.86,11.43 ENCODER.3
GND  (via drill 0.5)
  Top 0.305: ATMEGA32.28 15.24,24.13 15.88,24.77
  Top 0.406: 24.13,16.04 C3.2
  Bottom 0.406: C20.- 26.67,8.89 25.4,7.62 ENCODER.4
  other vias: 88.9,38.1 88.9,6.99 22.23,23.5 22.86,33.02 17.14,30.48 17.78,12.7 3.17,21.59 15.56,38.1 41.27,33.66 42.55,27.94 34.29,19.05 88.58,28.89 88.9,14.29 88.9,20.95 2.54,60.96 22.86,60.96 39.37,66.04 59.69,66.04 80.01,66.04 77.47,25.4 5.4,34.29 41.27,37.47 12.06,13.34
  pour Bottom (isolate 0.406, no thermals): 100.33,0 0,0 0,71.12 94.61,71.12 94.61,58.42 5.71,58.42 5.71,39.37 100.33,39.37
  pour Top (isolate 0.305): 100.33,0 0,0 0,69.85 94.61,69.85 94.61,57.78 5.71,57.78 5.71,39.37 100.33,39.37
L  (via drill 0.5)
  Top 0.61: R9.2 v17.78,50.8 | v17.78,58.42 v17.78,73.66
  Bottom 0.61: K6.S2 7.62,86.36 8.89,85.09 8.89,74.93 10.16,73.66 v17.78,73.66 29.21,73.66 | 29.21,73.66 49.53,73.66 | 49.53,73.66 69.85,73.66 | 69.85,73.66 88.9,73.66 90.17,74.93 90.17,85.09 88.9,86.36 K2.S2 | K3.S2 68.58,86.36 69.85,85.09 69.85,73.66 | K4.S2 48.26,86.36 49.53,85.09 49.53,73.66 | K5.S2 27.94,86.36 29.21,85.09 29.21,73.66 | v17.78,50.8 v17.78,58.42
MISO
  Top 0.305: ATMEGA32.2 12.04,5.69 11.43,5.08 PROGRAMER.1
MOSI
  Top 0.305: PROGRAMER.4 6.35,3.81 6.35,6.99 7.62,8.26 11.24,8.26 ATMEGA32.1
N$1
  Bottom 1.27: POWER-SUPPLY.1 52.78,12.14 53.98,13.34 59.69,13.34 60.96,14.61 B2.AC1
N$2
  Bottom 1.27: B2.AC2 66.04,8.89 64.77,7.62 POWER-SUPPLY.3
N$3
  Top 0.305: ATMEGA32.29 14.44,23.01 C2.1
N$4
  Top 0.305: PCF8583.1 41.27,14.61 Q2.1 41.91,12.06 41.27,11.43 C21.2
N$5
  Bottom 1.27: 7812.1 C5.1 88.9,33.02 C9.+ 86.36,29.84 82.55,29.84 78.61,33.78 K7.P2 76.91,33.96 74.35,31.4 68.23,31.4 B2.+
N$6
  Bottom 1.27: B2.- 60.96,32.38 62.53,33.96 K7.P1
N$7
  Top 1.27: K7.S1 71.98,38.96 83.19,50.16 C13.+
  Bottom 1.27: 92.71,48.26 7905.2 | C16.1 92.71,48.26 | C13.+ 88.27,48.26 92.71,48.26
N$8
  Bottom 1.27: D1.A 82.55,38.96 K7.S2 78.61,41.78 D2.A
N$9
  Bottom 1.27: 7805.1 68.58,44.45 69.85,43.18 C15.1 74.3,43.18 76.2,45.09 C12.+ 79.11,50.16 arc45 79.56,50.35 D2.C
N$10
  Bottom 1.27: 7805-1.1 C14.1 87,22.86 C11.+ 83.19,23.5 82.55,24.13 D1.C
N$11
  Top 0.305: POWER1.C 72.17,12.92 K7.2
  Bottom 0.61: Q1.C 71.12,5.08 D10.A
  Bottom 1.27: D10.A K7.2
N$12
  Bottom 0.61: Q1.B R2.2
N$13
  Top 0.305: PCF8583.2 41.27,15.88 Q2.2
N$14
  Top 0.305: D4.C 36.83,7.62 36.09,8.36 D3.C | 36.74,10.78 39.12,10.78 C21.1
  Top 0.406: 36.74,10.78 D3.C 36.09,13.44 34.92,14.61 PCF8583.8
N$15
  Top 0.305: D4.A BATTERY.2
N$16
  Top 0.305: PGA2311.11 24.77,46.77 R8.1
N$17
  Top 0.406: REMOTE.2 35.56,6.35 35.14,6.77 R6.2 31.08,6.77 C20.+
N$18
  Top 0.305: PGA2311.16 18.41,46.77 R9.1
N$19
  Top 0.305: PGA2311.9 27.3,46.77 R10.1
N$20
  Top 0.305: PGA2311.14 20.95,46.77 R7.1
N$21
  Top 0.305: K2.16 87.63,69.85 90.17,69.85 91.22,68.8 LED2.C
  Bottom 0.61: D5.A 86.36,61.91 Q3.C
  Bottom 0.813: K2.16 D5.A
N$22
  Top 0.305: R11.2 96.52,63.5 95.25,64.77 91.44,64.77 90.17,63.5 Q3.B
N$23
  Top 0.305: R16.1 89.12,66.24 LED2.A
N$24
  Top 0.305: R13.2 76.2,63.5 74.93,64.77 71.12,64.77 69.85,63.5 Q4.B
N$25
  Top 0.305: R18.1 68.8,66.24 LED3.A
N$26
  Top 0.305: R15.2 55.88,63.5 54.61,64.77 50.8,64.77 49.53,63.5 Q5.B
N$27
  Top 0.305: R20.1 48.48,66.24 LED4.A
N$28
  Top 0.305: R17.2 35.56,63.5 34.29,64.77 30.48,64.77 29.21,63.5 Q6.B
N$29
  Top 0.305: R21.1 28.16,66.24 LED5.A
N$30
  Top 0.305: R19.2 15.24,63.5 13.97,64.77 9.53,64.77 8.89,64.14 Q7.B
N$31
  Top 0.305: R22.1 7.84,66.24 LED6.A
N$32
  Top 0.305: K3.16 67.31,69.85 69.85,69.85 70.9,68.8 LED3.C
  Bottom 0.61: D6.A 66.04,61.91 Q4.C
  Bottom 0.813: K3.16 D6.A
N$33
  Top 0.61: R7.2 21.38,49.11 20.32,50.16 AUDIO-OUT.1
N$34
  Top 0.61: R8.2 24.34,49.11 25.4,50.16 AUDIO-OUT.3
N$35
  Bottom 0.61: AUX5.1 3.81,95.25 2.54,93.98 2.54,77.47 3.81,76.2 K6.P2
N$36
  Bottom 0.61: AUX5.2 13.97,95.25 15.24,93.98 15.24,77.47 13.97,76.2 K6.P1
N$37
  Bottom 0.61: AUX4.1 24.13,95.25 22.86,93.98 22.86,77.47 24.13,76.2 K5.P2
N$38
  Bottom 0.61: AUX4.2 34.29,95.25 35.56,93.98 35.56,77.47 34.29,76.2 K5.P1
N$39
  Bottom 0.61: AUX3.2 54.61,95.25 55.88,93.98 55.88,77.47 54.61,76.2 K4.P1
N$40
  Bottom 0.61: AUX3.1 44.45,95.25 43.18,93.98 43.18,77.47 44.45,76.2 K4.P2
N$41
  Bottom 0.61: AUX2.1 64.77,95.25 63.5,93.98 63.5,77.47 64.77,76.2 K3.P2
N$42
  Bottom 0.61: AUX2.2 74.93,95.25 76.2,93.98 76.2,77.47 74.93,76.2 K3.P1
N$43
  Bottom 0.61: AUX1.1 85.09,95.25 83.82,93.98 83.82,77.47 85.09,76.2 K2.P2
N$44
  Bottom 0.61: AUX1.2 95.25,95.25 96.52,93.98 96.52,77.47 95.25,76.2 K2.P1
N$45
  Top 0.305: K4.16 46.99,69.85 49.53,69.85 50.58,68.8 LED4.C
  Bottom 0.61: D7.A 45.72,61.91 Q5.C
  Bottom 0.813: K4.16 D7.A
N$46
  Top 0.305: K5.16 26.67,69.85 29.21,69.85 30.26,68.8 LED5.C
  Bottom 0.61: D8.A 25.4,61.91 Q6.C
  Bottom 0.813: K5.16 D8.A
N$47
  Top 0.305: K6.16 6.35,69.85 8.89,69.85 9.94,68.8 LED6.C
  Bottom 0.61: D9.A 5.08,62.23 Q7.C
  Bottom 0.813: K6.16 D9.A
N$48
  Top 0.305: R3.1 74.08,15.87 POWER1.A
N$93
  Top 0.305: JP2.3 50.16,13.97 49.53,13.34 44.45,13.34 43.81,13.97 43.81,21.59 43.18,22.23 CONTRAST.S
ON/OFF  (via drill 0.5)
  Top 0.305: ATMEGA32.15 23.19,13.64 v25.4,11.43
  Bottom 0.305: ON/OFF.1 43.18,8.89 40.64,11.43 v25.4,11.43
R  (via drill 0.5)
  Top 0.61: K2.S1 93.98,85.09 92.71,83.82 73.66,83.82 | 73.66,83.82 53.34,83.82 | 53.34,83.82 33.02,83.82 | 33.02,83.82 20.32,83.82 | 20.32,83.82 13.97,83.82 12.7,85.09 K6.S1 | K5.S1 33.02,83.82 | K4.S1 53.34,83.82 | K3.S1 73.66,83.82 | R10.2 v27.94,50.8 | v20.32,58.42 20.32,83.82
  Bottom 0.61: v27.94,50.8 27.94,55.88 26.67,57.15 21.59,57.15 v20.32,58.42
RELAY  (via drill 0.5)
  Top 0.305: ATMEGA32.44 4.89,11.24 3.17,9.53 3.17,1.91 4.45,0.64 79.38,0.64 80.64,1.91 80.64,5.71 79.38,6.99 v77.47,6.99
  Bottom 0.305: R2.1 76.62,8.47 77.47,7.62 v77.47,6.99
REMOTE
  Top 0.305: ATMEGA32.14 22.72,12.84 24.13,11.43 24.13,7.62 25.4,6.35 29.21,6.35 30.48,5.08 REMOTE.4
RESET
  Top 0.305: PROGRAMER.5 5.08,8.89 6.35,10.16 10.16,10.16 11.43,11.43 12.7,11.43 13.64,10.49 ATMEGA32.4 13.64,4.13 R1.2
RS
  Top 0.305: JP2.4 52.7,17.78 50.8,19.68 PCF8574..4
SCK
  Top 0.305: ATMEGA32.3 12.84,5.22 11.43,3.81 8.89,3.81 PROGRAMER.3
SCL  (via drill 0.5)
  Top 0.305: I2C.4 v31.11,24.13 31.75,23.5 31.75,18.41 30.48,17.14 PCF8583.6 27.73,17.14 R4.2 25.92,16.84 ATMEGA32.19 19.99,16.84 v19.05,17.78 | v31.11,27.94 33.66,30.48 43.18,30.48 45.09,32.38 48.26,32.38 49.53,31.11 PCF8574..14 | PCF8574.14 8.26,30.48 9.11,31.33 R12.2
  Top 0.406: v7.62,21.59 7.62,25.4 8.26,26.04 PCF8574.14
  Bottom 0.305: v19.05,17.78 8.89,17.78 7.62,19.05 v7.62,21.59 | v31.11,27.94 v31.11,24.13
SCLK  (via drill 0.5)
  Top 0.305: ATMEGA32.24 18.44,22.25 v22.23,26.04 | v24.77,31.11 PGA2311.6
  Bottom 0.305: v24.77,31.11 22.23,28.57 v22.23,26.04
SDA  (via drill 0.5)
  Top 0.305: PCF8583.5 27.94,18.41 | 27.94,18.41 27.73,18.41 R5.2 | ATMEGA32.20 27.16,17.64 27.94,18.41 | 24.13,20.95 v20.95,20.95 | I2C.3 32.38,26.67 33.02,27.3 33.02,28.57 34.29,29.84 43.81,29.84 45.72,31.75 47.62,31.75 48.26,31.11 PCF8574..15
  Top 0.406: R5.2 24.98,19.47 24.13,20.32 24.13,20.95 24.13,25.4 25.4,26.67 I2C.3 | PCF8574.15 9.53,24.34 R14.1 9.31,21.8 v10.16,20.95
  Bottom 0.305: v20.95,20.95 v10.16,20.95
SDI
  Top 0.305: ATMEGA32.25 17.64,22.72 20.95,26.04 PGA2311.3
VCC  (via drill 0.5)
  Top 0.305: ATMEGA32.38 8.09,16.04 6.67,17.46 C1.1 | D3.A 33.02,10.9 | ATMEGA32.27 16.04,23.66 v17.14,24.77 | R5.1 26.67,21.59 v25.4,22.86 | PROGRAMER.2 13.97,2.54 14.61,3.17 14.61,3.79 R1.1 14.82,6.78 C34.1 14.44,7.57 ATMEGA32.5
  Top 0.406: ATMEGA32.5 14.44,13.5 | 14.44,13.5 11.9,16.04 ATMEGA32.38 | 16.18,15.24 ATMEGA32.17 23.28,15.24 C3.1 R4.1 26.67,12.7 27.94,11.43 D3.A | 16.18,15.24 14.44,13.5 | ATMEGA32.27 16.04,15.24 16.18,15.24 | R6.1 33.02,10.9
  Bottom 0.305: v25.4,22.86 23.5,24.77 v17.14,24.77
  Bottom 1.27: 7805-2.3 C8.1 90.81,3.81 89.53,2.54 C30.+ 84.45,0.64 11.43,0.64 10.16,1.91 PROGRAMER.2
VDD
  Top 0.61: C22.+ 35.25,43.83 30.89,43.83 C23.2 30.06,43.81 23.81,43.81 23.5,44.13 PGA2311.12
  Top 0.813: C22.+ 60.66,43.52 C18.1
  Bottom 1.27: 7805.3 C32.+ C18.1

### Text on the board
tNames: 3/7/2018 | kulamario@yahoo.ie | DB4 | DB5 | DB6 | DB7 | +5V | GND | GND | +5V | SDA | Stereo Preamplifier PGA2311 v.1.0 | SCL | GND | +5V | V0 | RS | RW | E | A | B | SW | GND | IR | +5V | GND
tValues: 1N4148 | 1N4148 | 1N4148 | 1N4148 | 1N4148 | LED | LED | LED | LED | LED | BC547 | BC547 | BC547 | BC547 | BC547 | 470UF | 470UF | 470UF | 1 | 470UF | 1 | 470UF | 470UF | - | 470UF | + | BC547 | 470UF | 0 | ~ | ~